# EAGLE design HM_SENSOR_HOLDER (EAGLE 6.1)
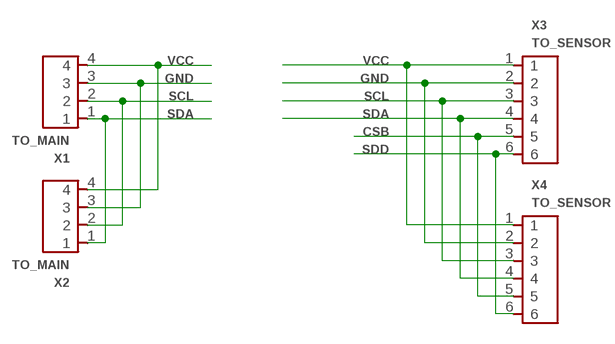
[diagram p0: schematic, sheet 1]

## Parts
X1  TO_MAIN  PIN4X1(2.54MM)  [PIN4X1_2.54MM]
X2  TO_MAIN  PIN4X1(2.54MM_SIDE)  [PIN4X1_2.54MM_SIDE_BOARD]
X3  TO_SENSOR  PIN6X1(2.54MM)  [PIN6X1_2.54MM]
X4  TO_SENSOR  PIN6X1(2.54MM_SIDE)  [PIN6X1_2.54MM_SIDE_BOARD]

## Nets
CSB: X3.5 X4.5
GND: X1.3 X2.3 X3.2 X4.2
SCL: X1.2 X2.2 X3.3 X4.3
SDA: X1.1 X2.1 X3.4 X4.4
SDD: X3.6 X4.6
VCC: X1.4 X2.4 X3.1 X4.1

## Library data of the parts
X1 X2 = __MyCommonLib1:PIN4X1
X3 X4 = __MyCommonLib1:PIN6X1

## Board
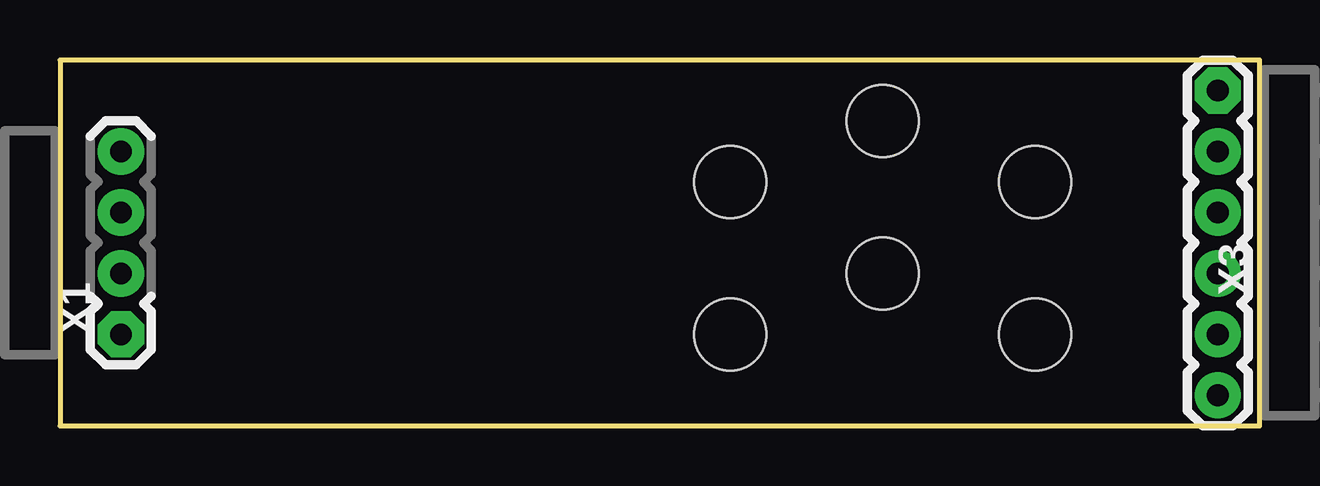
[diagram p1: board, top side]
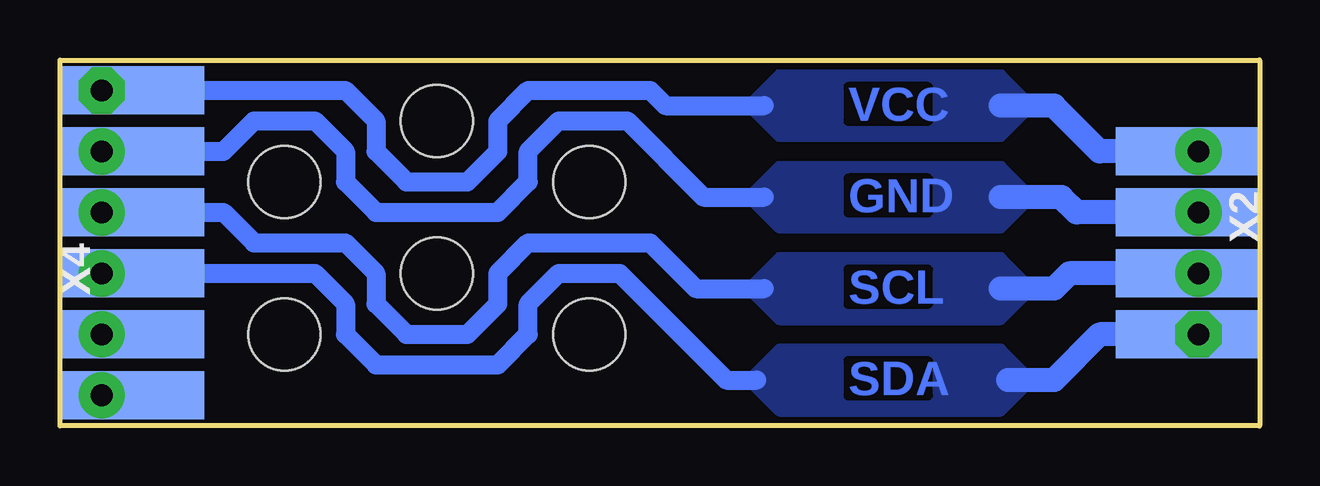
[diagram p2: board, bottom side, seen from below]

Size 50 x 15.24 mm. Coordinates in mm from the lower left corner, seen from the top.
Outline: 0,0 50,0 50,15.24 0,15.24 0,0
Copper layers (1*16): Top 0.035mm / dielectric 1.5mm / Bottom 0.035mm
Design rules: minimum track width 10mil, minimum drill 24mil, track to track 8mil, track to pad 8mil, pad to pad 8mil, via to via 8mil, smd to smd 0mil, copper to edge 0mil, drill to drill 8mil, minimum pad ring 10mil, minimum via ring 8mil, stop-mask expansion 4mil, vias tented up to drill 0mil, thermal gap 10mil
Holes 3 mm at 34.29,12.7 27.94,10.16 34.29,6.35 27.94,3.81 40.64,3.81 40.64,10.16

### Footprints (pad centres in the part's own frame; a part is rotated, then mirrored left to right if it is on the bottom)
PIN4X1_2.54MM = drill 0.9 pad 1.93 octagon: 1 -3.81,0 | drill 0.9 pad 1.93: 2 -1.27,0; 3 1.27,0; 4 3.81,0
PIN4X1_2.54MM_SIDE_BOARD = smd 2 x 6: 1 -3.81,3; 2 -1.27,3; 3 1.27,3; 4 3.81,3
PIN6X1_2.54MM = drill 0.9 pad 1.93 octagon: 1 -6.35,0 | drill 0.9 pad 1.93: 2 -3.81,0; 3 -1.27,0; 4 1.27,0; 5 3.81,0; 6 6.35,0
PIN6X1_2.54MM_SIDE_BOARD = smd 2 x 6: 1 -6.35,3; 2 -3.81,3; 3 -1.27,3; 4 1.27,3; 5 3.81,3; 6 6.35,3

### Placement (x,y rotation side)
X1  2.54,7.62 90 top
X2  0,7.62 90 bottom
X3  48.26,7.62 270 top
X4  50,7.62 270 bottom

### Tracks (layer width: path | path; a pad name or v marks a point on that pad's centre or on a via)
CSB
  Bottom 1: X4.5 X3.5
GND
  Bottom 0.8: X4.2 43.18,11.43 41.91,12.7 39.37,12.7 38.1,11.43 38.1,10.16 36.83,8.89 31.75,8.89 30.48,10.16 30.48,11.43 29.21,12.7 26.35,12.7 23.18,9.53 20.64,9.53
  Bottom 1: 10.79,9.53 8.26,9.53 7.62,8.89 X2.3 X1.3 | X4.2 X3.2
  pour Bottom: 10.79,10.79 9.53,9.53 10.79,8.26 20,8.26 21.27,9.53 20,10.79
SCL
  Bottom 0.8: X4.3 43.18,8.89 41.91,7.62 38.1,7.62 36.83,6.35 36.83,5.08 35.56,3.81 33.02,3.81 31.75,5.08 31.75,6.35 30.48,7.62 25.4,7.62 23.5,5.71 20.64,5.71
  Bottom 1: 10.79,5.71 8.57,5.71 7.94,6.35 X2.2 X1.2 | X4.3 X3.3
  pour Bottom: 9.53,5.71 10.79,6.99 20,6.99 21.27,5.71 20,4.45 10.79,4.45
SDA
  Bottom 0.8: X4.4 39.37,6.35 38.1,5.08 38.1,3.81 36.83,2.54 31.75,2.54 30.48,3.81 30.48,5.08 29.21,6.35 26.67,6.35 22.23,1.91 20.95,1.91
  Bottom 1: 10.48,1.91 8.57,1.91 6.67,3.81 X2.1 X1.1 | X4.4 X3.4
  pour Bottom: 9.53,1.91 10.79,3.17 20,3.17 21.27,1.91 20,0.64 10.79,0.64
SDD
  Bottom 1: X4.6 X3.6
VCC
  Bottom 0.8: X4.1 38.1,13.97 36.83,12.7 36.83,11.43 35.56,10.16 33.02,10.16 31.75,11.43 31.75,12.7 30.48,13.97 25.4,13.97 24.77,13.34 20.64,13.34
  Bottom 1: 10.79,13.34 8.57,13.34 6.67,11.43 X2.4 X1.4 | X4.1 X3.1
  pour Bottom: 10.79,14.61 9.53,13.34 10.79,12.06 20,12.06 21.27,13.34 20,14.61

### Text on the board
Bottom: VCC | GND | SCL | SDA